# Altium schematic sheet CONN.SchDoc
size A4; SheetNumber: 10; SheetTotal: 10
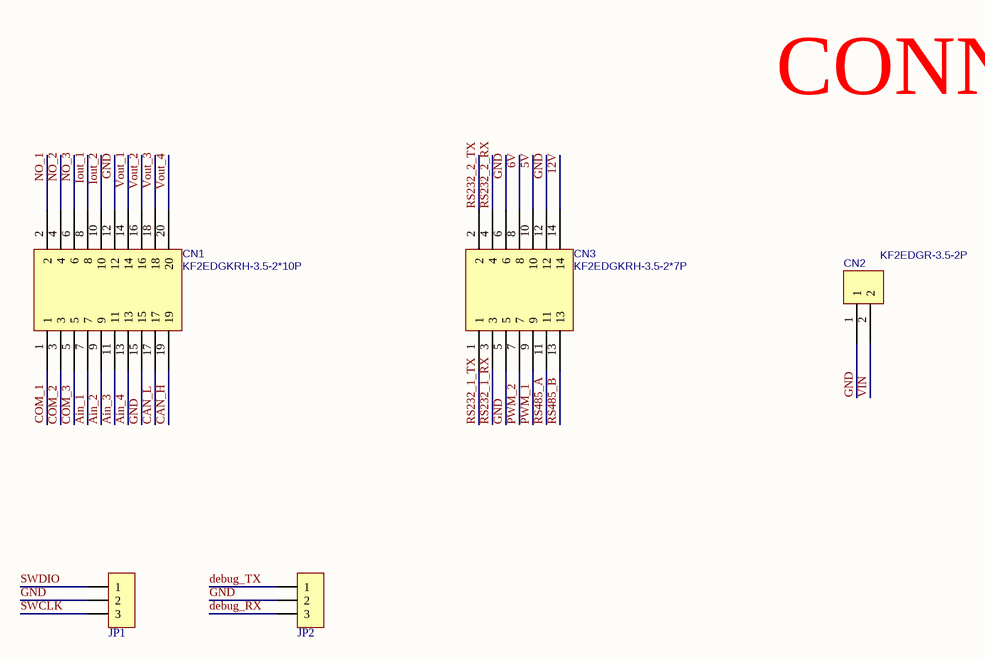
[diagram p0: CONN.SchDoc]

## Parts
CN1  KF2EDGKRH-3.5-2*10P  [CONN-TH_20P-P3.50_KEFA_KF2EDGKRH-3.5-2X10P]
CN2  KF2EDGR-3.5-2P  [CONN-TH_P3.50_KF2EDGR-3.5-2P]
CN3  KF2EDGKRH-3.5-2*7P  [CONN-TH_14P-P3.50_KEFA_KF2EDGKRH-3.5-2X7P]
JP1  HDR-1X3  [HDR2.54-LI-3P]  (value not drawn)
JP2  HDR-1X3  [HDR2.54-LI-3P]  (value not drawn)

## Nets
5V: CN3.10
6V: CN3.8
12V: CN3.14
Ain_1: CN1.7
Ain_2: CN1.9
Ain_3: CN1.11
Ain_4: CN1.13
CAN_H: CN1.19
CAN_L: CN1.17
COM_1: CN1.1
COM_2: CN1.3
COM_3: CN1.5
debug_RX: JP2.3
debug_TX: JP2.1
GND: CN1.12 CN1.15 CN2.1 CN3.5 CN3.6 CN3.12 JP1.2 JP2.2
Iout_1: CN1.8
Iout_2: CN1.10
NO_1: CN1.2
NO_2: CN1.4
NO_3: CN1.6
PWM_1: CN3.9
PWM_2: CN3.7
RS232_1_RX: CN3.3
RS232_1_TX: CN3.1
RS232_2_RX: CN3.4
RS232_2_TX: CN3.2
RS485_A: CN3.11
RS485_B: CN3.13
SWCLK: JP1.3
SWDIO: JP1.1
VIN: CN2.2
Vout_1: CN1.14
Vout_2: CN1.16
Vout_3: CN1.18
Vout_4: CN1.20

## Notes on the sheet
- CONN

## Library data of the parts
CN1 = KF2EDGKRH-3.5-2*10P: 20P 间距P=3.5mm / 插拔式接线端子; BOM_Manufacturer: KEFA(科发); Contributor: LCSC; BOM_Supplier: LCSC; BOM_Supplier Part: C2923169; BOM_Manufacturer Part: KF2EDGKRH-3.5-2*10P; spicePre: C; spiceSymbolName: KF2EDGKRH-3.5-2*10P
CN2 = KF2EDGR-3.5-2P: 3.5mm 排数:1 每排P数:2 弯针 / 插拔式接线端子; BOM_Manufacturer: Cixi Kefa Elec; Contributor: LCSC; BOM_Supplier: LCSC; BOM_Supplier Part: C441171; BOM_Manufacturer Part: KF2EDGR-3.5-2P; BOM_JLCPCB Part Class: Extended Part; spicePre: C; spiceSymbolName: KF2EDGR-3.5-2P
CN3 = KF2EDGKRH-3.5-2*7P: 14P 间距P=3.5mm / 插拔式接线端子; BOM_Manufacturer: KEFA(科发); Contributor: LCSC; BOM_Supplier: LCSC; BOM_Supplier Part: C2923166; BOM_Manufacturer Part: KF2EDGKRH-3.5-2*7P; spicePre: C; spiceSymbolName: KF2EDGKRH-3.5-2*7P_C2923166
JP1 JP2 = Header 3: 3P排针; BOM名称: 3P接插件; 版权归属: 源创客; 学习资源: www.ooocke.com